# Altium project dipext-sock_r2.PrjPcb
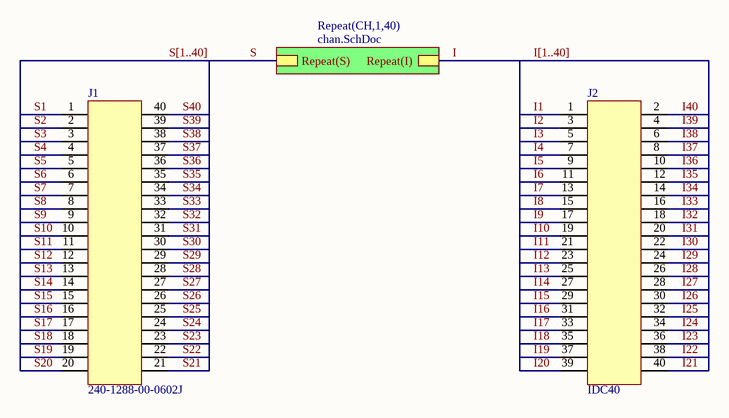
[diagram p0: top.SchDoc]
2 sheets, 42 parts. Net scope: hierarchical (ports join the sheet entries above them; power ports are global).
Board file: dipext-sock_r2.PcbDoc
Sheets:
  top.SchDoc
    CH1 = chan.SchDoc
    CH2 = chan.SchDoc
    CH3 = chan.SchDoc
    CH4 = chan.SchDoc
    CH5 = chan.SchDoc
    CH6 = chan.SchDoc
    CH7 = chan.SchDoc
    CH8 = chan.SchDoc
    CH9 = chan.SchDoc
    CH10 = chan.SchDoc
    CH11 = chan.SchDoc
    CH12 = chan.SchDoc
    CH13 = chan.SchDoc
    CH14 = chan.SchDoc
    CH15 = chan.SchDoc
    CH16 = chan.SchDoc
    CH17 = chan.SchDoc
    CH18 = chan.SchDoc
    CH19 = chan.SchDoc
    CH20 = chan.SchDoc
    CH21 = chan.SchDoc
    CH22 = chan.SchDoc
    CH23 = chan.SchDoc
    CH24 = chan.SchDoc
    CH25 = chan.SchDoc
    CH26 = chan.SchDoc
    CH27 = chan.SchDoc
    CH28 = chan.SchDoc
    CH29 = chan.SchDoc
    CH30 = chan.SchDoc
    CH31 = chan.SchDoc
    CH32 = chan.SchDoc
    CH33 = chan.SchDoc
    CH34 = chan.SchDoc
    CH35 = chan.SchDoc
    CH36 = chan.SchDoc
    CH37 = chan.SchDoc
    CH38 = chan.SchDoc
    CH39 = chan.SchDoc
    CH40 = chan.SchDoc

## Sheet top.SchDoc
size A

### Parts
J1  240-1288-00-0602J  [240-1300-00-0602J]
J2  IDC40  [IDC40]

### Sub-sheets
Repeat(CH,1,40) = chan.SchDoc: Repeat(I), Repeat(S)

### Nets
I: sheet Repeat(CH,1,40)/Repeat(I)
I1: J2.1
I2: J2.3
I3: J2.5
I4: J2.7
I5: J2.9
I6: J2.11
I7: J2.13
I8: J2.15
I9: J2.17
I10: J2.19
I11: J2.21
I12: J2.23
I13: J2.25
I14: J2.27
I15: J2.29
I16: J2.31
I17: J2.33
I18: J2.35
I19: J2.37
I20: J2.39
I21: J2.40
I22: J2.38
I23: J2.36
I24: J2.34
I25: J2.32
I26: J2.30
I27: J2.28
I28: J2.26
I29: J2.24
I30: J2.22
I31: J2.20
I32: J2.18
I33: J2.16
I34: J2.14
I35: J2.12
I36: J2.10
I37: J2.8
I38: J2.6
I39: J2.4
I40: J2.2
S: sheet Repeat(CH,1,40)/Repeat(S)
S1: J1.1
S2: J1.2
S3: J1.3
S4: J1.4
S5: J1.5
S6: J1.6
S7: J1.7
S8: J1.8
S9: J1.9
S10: J1.10
S11: J1.11
S12: J1.12
S13: J1.13
S14: J1.14
S15: J1.15
S16: J1.16
S17: J1.17
S18: J1.18
S19: J1.19
S20: J1.20
S21: J1.21
S22: J1.22
S23: J1.23
S24: J1.24
S25: J1.25
S26: J1.26
S27: J1.27
S28: J1.28
S29: J1.29
S30: J1.30
S31: J1.31
S32: J1.32
S33: J1.33
S34: J1.34
S35: J1.35
S36: J1.36
S37: J1.37
S38: J1.38
S39: J1.39
S40: J1.40

### Buses and harness runs
bus I[1..40]
bus S[1..40]

### Library data of the parts
J1 = 240-1288-00-0602J: DIP40 ZIF

## Sheet chan.SchDoc
size A
Used 40 times, as channels CH1, CH2, CH3, CH4, CH5, CH6, CH7, CH8, CH9, CH10, CH11, CH12, CH13, CH14, CH15, CH16, CH17, CH18, CH19, CH20, CH21, CH22, CH23, CH24, CH25, CH26, CH27, CH28, CH29, CH30, CH31, CH32, CH33, CH34, CH35, CH36, CH37, CH38, CH39, CH40. Parts and nets are listed once, with the designators drawn on the sheet.
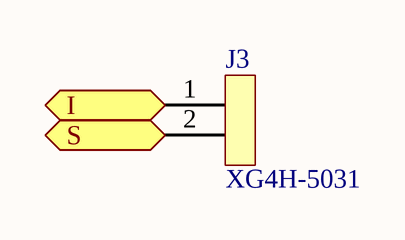
[diagram p1: chan.SchDoc]

### Parts
J3  XG4H-5031  [SIL2]

### Ports
I, S

### Nets
I: J3.1 ; port I
S: J3.2 ; port S

### Channels
CH1: designators J3=1; ports I=I1 S=S1
CH2: designators J3=2; ports I=I2 S=S2
CH3: designators J3=3; ports I=I3 S=S3
CH4: designators J3=4; ports I=I4 S=S4
CH5: designators J3=5; ports I=I5 S=S5
CH6: designators J3=6; ports I=I6 S=S6
CH7: designators J3=7; ports I=I7 S=S7
CH8: designators J3=8; ports I=I8 S=S8
CH9: designators J3=9; ports I=I9 S=S9
CH10: designators J3=10; ports I=I10 S=S10
CH11: designators J3=11; ports I=I11 S=S11
CH12: designators J3=12; ports I=I12 S=S12
CH13: designators J3=13; ports I=I13 S=S13
CH14: designators J3=14; ports I=I14 S=S14
CH15: designators J3=15; ports I=I15 S=S15
CH16: designators J3=16; ports I=I16 S=S16
CH17: designators J3=17; ports I=I17 S=S17
CH18: designators J3=18; ports I=I18 S=S18
CH19: designators J3=19; ports I=I19 S=S19
CH20: designators J3=20; ports I=I20 S=S20
CH21: designators J3=21; ports I=I21 S=S21
CH22: designators J3=22; ports I=I22 S=S22
CH23: designators J3=23; ports I=I23 S=S23
CH24: designators J3=24; ports I=I24 S=S24
CH25: designators J3=25; ports I=I25 S=S25
CH26: designators J3=26; ports I=I26 S=S26
CH27: designators J3=27; ports I=I27 S=S27
CH28: designators J3=28; ports I=I28 S=S28
CH29: designators J3=29; ports I=I29 S=S29
CH30: designators J3=30; ports I=I30 S=S30
CH31: designators J3=31; ports I=I31 S=S31
CH32: designators J3=32; ports I=I32 S=S32
CH33: designators J3=33; ports I=I33 S=S33
CH34: designators J3=34; ports I=I34 S=S34
CH35: designators J3=35; ports I=I35 S=S35
CH36: designators J3=36; ports I=I36 S=S36
CH37: designators J3=37; ports I=I37 S=S37
CH38: designators J3=38; ports I=I38 S=S38
CH39: designators J3=39; ports I=I39 S=S39
CH40: designators J3=40; ports I=I40 S=S40

### Library data of the parts
J3 = XG4H-5031: Fencepost 2x1 0.1"

## Nets that join several sheets
I1: top (J2.1), CH1 (1.1)
I2: top (J2.3), CH2 (2.1)
I3: top (J2.5), CH3 (3.1)
I4: top (J2.7), CH4 (4.1)
I5: top (J2.9), CH5 (5.1)
I6: top (J2.11), CH6 (6.1)
I7: top (J2.13), CH7 (7.1)
I8: top (J2.15), CH8 (8.1)
I9: top (J2.17), CH9 (9.1)
I10: top (J2.19), CH10 (10.1)
I11: top (J2.21), CH11 (11.1)
I12: top (J2.23), CH12 (12.1)
I13: top (J2.25), CH13 (13.1)
I14: top (J2.27), CH14 (14.1)
I15: top (J2.29), CH15 (15.1)
I16: top (J2.31), CH16 (16.1)
I17: top (J2.33), CH17 (17.1)
I18: top (J2.35), CH18 (18.1)
I19: top (J2.37), CH19 (19.1)
I20: top (J2.39), CH20 (20.1)
I21: top (J2.40), CH21 (21.1)
I22: top (J2.38), CH22 (22.1)
I23: top (J2.36), CH23 (23.1)
I24: top (J2.34), CH24 (24.1)
I25: top (J2.32), CH25 (25.1)
I26: top (J2.30), CH26 (26.1)
I27: top (J2.28), CH27 (27.1)
I28: top (J2.26), CH28 (28.1)
I29: top (J2.24), CH29 (29.1)
I30: top (J2.22), CH30 (30.1)
I31: top (J2.20), CH31 (31.1)
I32: top (J2.18), CH32 (32.1)
I33: top (J2.16), CH33 (33.1)
I34: top (J2.14), CH34 (34.1)
I35: top (J2.12), CH35 (35.1)
I36: top (J2.10), CH36 (36.1)
I37: top (J2.8), CH37 (37.1)
I38: top (J2.6), CH38 (38.1)
I39: top (J2.4), CH39 (39.1)
I40: top (J2.2), CH40 (40.1)
S1: top (J1.1), CH1 (1.2)
S2: top (J1.2), CH2 (2.2)
S3: top (J1.3), CH3 (3.2)
S4: top (J1.4), CH4 (4.2)
S5: top (J1.5), CH5 (5.2)
S6: top (J1.6), CH6 (6.2)
S7: top (J1.7), CH7 (7.2)
S8: top (J1.8), CH8 (8.2)
S9: top (J1.9), CH9 (9.2)
S10: top (J1.10), CH10 (10.2)
S11: top (J1.11), CH11 (11.2)
S12: top (J1.12), CH12 (12.2)
S13: top (J1.13), CH13 (13.2)
S14: top (J1.14), CH14 (14.2)
S15: top (J1.15), CH15 (15.2)
S16: top (J1.16), CH16 (16.2)
S17: top (J1.17), CH17 (17.2)
S18: top (J1.18), CH18 (18.2)
S19: top (J1.19), CH19 (19.2)
S20: top (J1.20), CH20 (20.2)
S21: top (J1.21), CH21 (21.2)
S22: top (J1.22), CH22 (22.2)
S23: top (J1.23), CH23 (23.2)
S24: top (J1.24), CH24 (24.2)
S25: top (J1.25), CH25 (25.2)
S26: top (J1.26), CH26 (26.2)
S27: top (J1.27), CH27 (27.2)
S28: top (J1.28), CH28 (28.2)
S29: top (J1.29), CH29 (29.2)
S30: top (J1.30), CH30 (30.2)
S31: top (J1.31), CH31 (31.2)
S32: top (J1.32), CH32 (32.2)
S33: top (J1.33), CH33 (33.2)
S34: top (J1.34), CH34 (34.2)
S35: top (J1.35), CH35 (35.2)
S36: top (J1.36), CH36 (36.2)
S37: top (J1.37), CH37 (37.2)
S38: top (J1.38), CH38 (38.2)
S39: top (J1.39), CH39 (39.2)
S40: top (J1.40), CH40 (40.2)